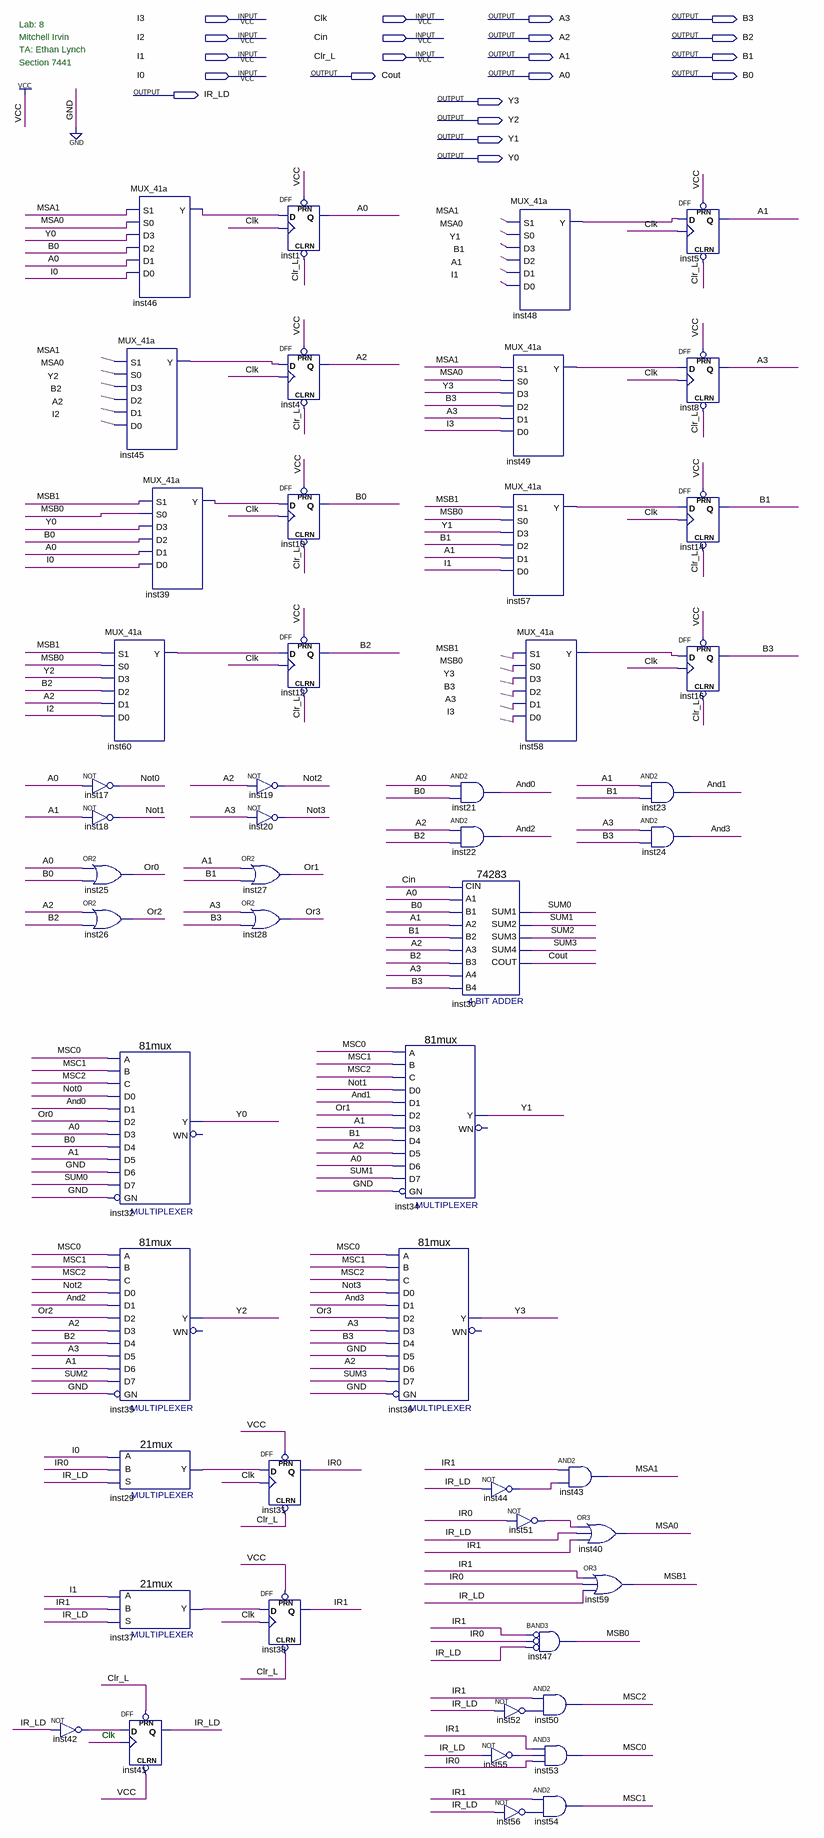
[diagram p0: schematic sheet]
// Quartus schematic part1_2.bdf as structural Verilog: 51 symbols, 21 pins
module part1_2 (
  input  I3,
  input  Clk,
  input  I2,
  input  Cin,
  input  I1,
  input  Clr_L,
  input  I0,
  output A3,
  output B3,
  output A2,
  output B2,
  output A1,
  output B1,
  output Cout,
  output A0,
  output B0,
  output IR_LD,
  output Y3,
  output Y2,
  output Y1,
  output Y0
);

  wire And0, And1, And2, And3, inst29_y, inst37_y, inst39_y, inst42_out, inst44_out, inst45_y, inst46_y,
       inst48_y, inst49_y, inst51_out, inst52_out, inst55_out, inst56_out, inst57_y, inst58_y, inst60_y, IR0,
       IR1, MSA0, MSA1, MSB0, MSB1, MSC0, MSC1, MSC2, Not0, Not1, Not2, Not3, Or0, Or1, Or2, Or3, SUM0, SUM1,
       SUM2, SUM3;

  not inst42 (inst42_out, IR_LD);
  MUX_41a inst60 (.S1(MSB1), .S0(MSB0), .D3(Y2), .D2(B2), .D1(A2), .D0(I2), .Y(inst60_y));
  not inst17 (Not0, A0);
  not inst18 (Not1, A1);
  or inst25 (Or0, A0, B0);
  or inst26 (Or2, A2, B2);
  \81mux  inst32 (
    .C(MSC2), .D1(And0), .D0(Not0), .D5(A1), .D4(B0), .D2(Or0), .D3(A0), .GN(1'b0), .D7(SUM0), .D6(1'b0),
    .A(MSC0), .B(MSC1), .Y(Y0));  // open: WN
  \81mux  inst35 (
    .C(MSC2), .D1(And2), .D0(Not2), .D5(A3), .D4(B2), .D2(Or2), .D3(A2), .GN(1'b0), .D7(SUM2), .D6(A1),
    .A(MSC0), .B(MSC1), .Y(Y2));  // open: WN
  \21mux  inst29 (.S(IR_LD), .B(IR0), .A(I0), .Y(inst29_y));
  \21mux  inst37 (.S(IR_LD), .B(IR1), .A(I1), .Y(inst37_y));
  MUX_41a inst46 (.S1(MSA1), .S0(MSA0), .D3(Y0), .D2(B0), .D1(A0), .D0(I0), .Y(inst46_y));
  MUX_41a inst45 (.S1(MSA1), .S0(MSA0), .D3(Y2), .D2(B2), .D1(A2), .D0(I2), .Y(inst45_y));
  MUX_41a inst39 (.S1(MSB1), .S0(MSB0), .D3(Y0), .D2(B0), .D1(A0), .D0(I0), .Y(inst39_y));
  DFF inst41 (.CLRN(1'b1), .CLK(Clk), .D(inst42_out), .PRN(Clr_L), .Q(IR_LD));
  not inst19 (Not2, A2);
  not inst20 (Not3, A3);
  or inst27 (Or1, A1, B1);
  or inst28 (Or3, A3, B3);
  DFF inst31 (.CLRN(Clr_L), .CLK(Clk), .D(inst29_y), .PRN(1'b1), .Q(IR0));
  DFF inst38 (.CLRN(Clr_L), .CLK(Clk), .D(inst37_y), .PRN(1'b1), .Q(IR1));
  DFF inst1 (.CLRN(Clr_L), .CLK(Clk), .D(inst46_y), .PRN(1'b1), .Q(A0));
  DFF inst4 (.CLRN(Clr_L), .CLK(Clk), .D(inst45_y), .PRN(1'b1), .Q(A2));
  DFF inst10 (.CLRN(Clr_L), .CLK(Clk), .D(inst39_y), .PRN(1'b1), .Q(B0));
  DFF inst12 (.CLRN(Clr_L), .CLK(Clk), .D(inst60_y), .PRN(1'b1), .Q(B2));
  \81mux  inst34 (
    .C(MSC2), .D1(And1), .D0(Not1), .D5(A2), .D4(B1), .D2(Or1), .D3(A1), .GN(1'b0), .D7(SUM1), .D6(A0),
    .A(MSC0), .B(MSC1), .Y(Y1));  // open: WN
  \81mux  inst36 (
    .C(MSC2), .D1(And3), .D0(Not3), .D5(1'b0), .D4(B3), .D2(Or3), .D3(A3), .GN(1'b0), .D7(SUM3), .D6(A2),
    .A(MSC0), .B(MSC1), .Y(Y3));  // open: WN
  and inst21 (And0, A0, B0);
  and inst22 (And2, A2, B2);
  \74283  inst30 (
    .CIN(Cin), .A1(A0), .A2(A1), .B2(B1), .A3(A2), .A4(A3), .B4(B3), .B1(B0), .B3(B2), .SUM4(SUM3),
    .COUT(Cout), .SUM1(SUM0), .SUM2(SUM1), .SUM3(SUM2));
  MUX_41a inst48 (.S1(MSA1), .S0(MSA0), .D3(Y1), .D2(B1), .D1(A1), .D0(I1), .Y(inst48_y));
  MUX_41a inst49 (.S1(MSA1), .S0(MSA0), .D3(Y3), .D2(B3), .D1(A3), .D0(I3), .Y(inst49_y));
  MUX_41a inst57 (.S1(MSB1), .S0(MSB0), .D3(Y1), .D2(B1), .D1(A1), .D0(I1), .Y(inst57_y));
  MUX_41a inst58 (.S1(MSB1), .S0(MSB0), .D3(Y3), .D2(B3), .D1(A3), .D0(I3), .Y(inst58_y));
  not inst44 (inst44_out, IR_LD);
  not inst51 (inst51_out, IR0);
  not inst52 (inst52_out, IR_LD);
  not inst55 (inst55_out, IR_LD);
  not inst56 (inst56_out, IR_LD);
  and inst43 (MSA1, IR1, inst44_out);
  and inst47 (MSB0, ~IR1, ~IR0, ~IR_LD);  // BAND3
  and inst50 (MSC2, IR1, inst52_out);
  and inst53 (MSC0, IR1, inst55_out, IR0);
  and inst54 (MSC1, IR1, inst56_out);
  or inst40 (MSA0, inst51_out, IR_LD, IR1);
  or inst59 (MSB1, IR1, IR0, IR_LD);
  and inst23 (And1, A1, B1);
  and inst24 (And3, A3, B3);
  DFF inst5 (.CLRN(Clr_L), .CLK(Clk), .D(inst48_y), .PRN(1'b1), .Q(A1));
  DFF inst8 (.CLRN(Clr_L), .CLK(Clk), .D(inst49_y), .PRN(1'b1), .Q(A3));
  DFF inst14 (.CLRN(Clr_L), .CLK(Clk), .D(inst57_y), .PRN(1'b1), .Q(B1));
  DFF inst16 (.CLRN(Clr_L), .CLK(Clk), .D(inst58_y), .PRN(1'b1), .Q(B3));

  // Notes on the sheet:
  //   Lab: 8
  //   Mitchell Irvin
  //   TA: Ethan Lynch
  //   Section 7441
  //   Clk
endmodule
